# Altium project GATE_BOARD.PrjPCB
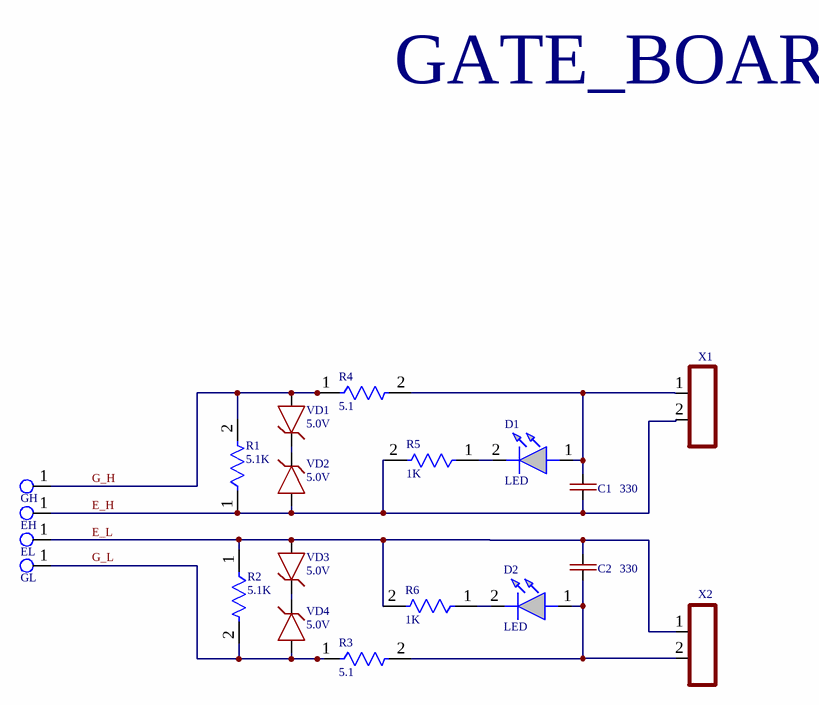
[diagram p0: GATE_BOARD.SchDoc]
1 sheet, 20 parts. Net scope: global (net labels, ports and power ports of the same name join across sheets).
Board file: GATE_BOARD.PcbDoc

## Sheet GATE_BOARD.SchDoc
size A1; SPICEModelCacheYQEDCYZF: <root> / <DocumentId>YQEDCYZF</DocumentId> / </root>

### Parts
C1  330  [CAP-0805]
C2  330  [CAP-0805]
D1  LED  [LED_BLUE]
D2  LED  [LED_BLUE]
EH  (no value)  [Test_Point]
EL  (no value)  [Test_Point]
GH  (no value)  [Test_Point]
GL  (no value)  [Test_Point]
R1  5.1K  [RES-1206]
R2  5.1K  [RES-1206]
R3  5.1  [RES-1206]
R4  5.1  [RES-1206]
R5  1K  [RES-0805]
R6  1K  [RES-0805]
VD1  5.0V  [DO-214AA]
VD2  5.0V  [DO-214AA]
VD3  5.0V  [DO-214AA]
VD4  5.0V  [DO-214AA]
X1  CONN-2-PIN  [CONN-PLS-2-2.54mm]  (value not drawn)
X2  CONN-2-PIN  [CONN-PLS-2-2.54mm]  (value not drawn)

### Nets
E_H: C1.1 EH.1(G9) R1.1 R5.2 VD2.1(A) X1.2
NetC1_2: C1.2 D1.1(A) R4.2 X1.1
NetC2_1: C2.1 D2.1(A) R3.2 X2.2
NetC2_2: C2.2 EL.1(G9) R2.1 R6.2 VD3.1(A) X2.1
NetD1_2: D1.2(K) R5.1
NetD2_2: D2.2(K) R6.1
NetGH_1: GH.1(G9) R1.2 R4.1 VD1.1(A)
NetGL_1: GL.1(G9) R2.2 R3.1 VD4.1(A)
NetVD1_2: VD1.2(C) VD2.2(C)
NetVD3_2: VD3.2(C) VD4.2(C)

### Notes on the sheet
- GATE_BOARD
- Labels drawn without touching a wire or pin: E_L, G_H, G_L

### Library data of the parts
C1 C2 = CAP-NON-POLAR
D1 D2 = LED: WURTH ELEKTRONIK - 151031YS06000 - LED, Yellow, Through Hole, T-1 (3mm), 30 mA, 2 V, 590 nm; Geometry.Height: 5.5mm; Manufacturer_Name: Wurth Elektronik; Manufacturer_Part_Number: 151031YS06000; Mouser Part Number: 710-151031YS06000; Mouser Price/Stock: https://www.mouser.co.uk/ProductDetail/Wurth-Elektronik/151031YS06000?qs=LlUlMxKIyB3xSYYW%252BcuBiQ%3D%3D; Arrow Part Number: *; Arrow Price/Stock: *; Mouser Testing Part Number: *; Mouser Testing Price/Stock: *; Datasheet Link: https://katalog.we-online.de/led/datasheet/151031YS06000.pdf
EH EL GH GL = TP_PCB?: Test_Point
R1-R6 = RES-CONST
VD1-VD4 = SMBJ15A